# EAGLE design QBar-Graph-V1 (EAGLE 6.0)
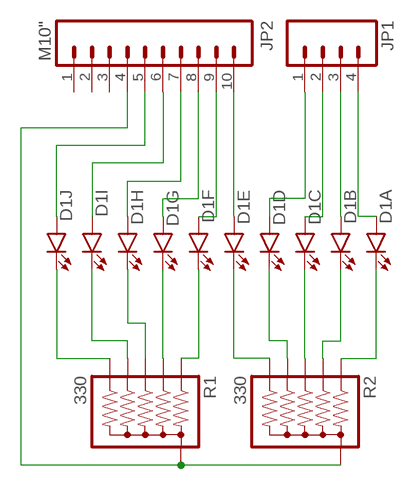
[diagram p0: schematic, sheet 1]

## Parts
D1  LED_BARGRAPH_10  [LED_BARGAPH_10]
JP1  M04PTH  [1X04]
JP2  M10"  [1X10]
R1  330  RPACK-BUSSED-SIP-PTH-5  [RPACK-SIP-PTH-5]
R2  330  RPACK-BUSSED-SIP-PTH-5  [RPACK-SIP-PTH-5]

## Nets
N$1: D1.11(J:C) R1.P$6
N$2: D1.12(I:C) R1.P$5
N$3: D1.13(H:C) R1.P$4
N$4: D1.14(G:C) R1.P$3
N$5: D1.15(F:C) R1.P$2
N$6: D1.20(A:C) R2.P$2
N$7: D1.19(B:C) R2.P$3
N$8: D1.18(C:C) R2.P$4
N$9: D1.17(D:C) R2.P$5
N$10: D1.16(E:C) R2.P$6
N$11: JP2.4 R1.P$1 R2.P$1
N$12: D1.1(A:A) JP1.4
N$13: D1.2(B:A) JP1.3
N$14: D1.3(C:A) JP1.2
N$15: D1.4(D:A) JP1.1
N$16: D1.5(E:A) JP2.10
N$17: D1.6(F:A) JP2.9
N$18: D1.7(G:A) JP2.8
N$19: D1.8(H:A) JP2.7
N$20: D1.9(I:A) JP2.6
N$21: D1.10(J:A) JP2.5
Unconnected: JP2.1 JP2.2 JP2.3

## Library data of the parts
D1 = SFE LED:LED_BARGRAPH_10: 10-Segment LED Bar Graph SFE part numbers: COM-09935 (red, Vf = 2.1V, Ifmax = 20mA) COM-09936 (yellow, Vf = 2.1V, Ifmax = 20mA) COM-09937 (blue, Vf = 3.4V, Ifmax = 20mA) COM-09938 (green, Vf = 3.4V, Ifmax = 20mA)
JP1 = SFE Connectors:M04: Header 4 Standard 4-pin 0.1" header. Use with straight break away headers (SKU : PRT-00116), right angle break away headers (PRT-00553), swiss pins (PRT-00743), machine pins (PRT-00117), and female headers (PRT-00115). Molex polarized connector foot print use with SKU : PRT-08231 with associated crimp pins and housings. 1MM SMD Version SKU: PRT-10208
JP2 = SFE Connectors:M10: Header 10 Standard 10-pin 0.1" header. Use with straight break away headers (SKU : PRT-00116), right angle break away headers (PRT-00553), swiss pins (PRT-00743), machine pins (PRT-00117), and female headers (PRT-00115).
R1 R2 = SFE Passives:RPACK*: BOURNS 4600X series thick-film SIP resistor packs Five resistors bussed to a single pin (denoted by dot). 0.2W / resistor datasheet <http://dlnmh9ip6v2uc.cloudfront.net/datasheets/Components/General/4600x.pdf> SFE parts COM-10855 (330), COM-10856 (10K)

## Board
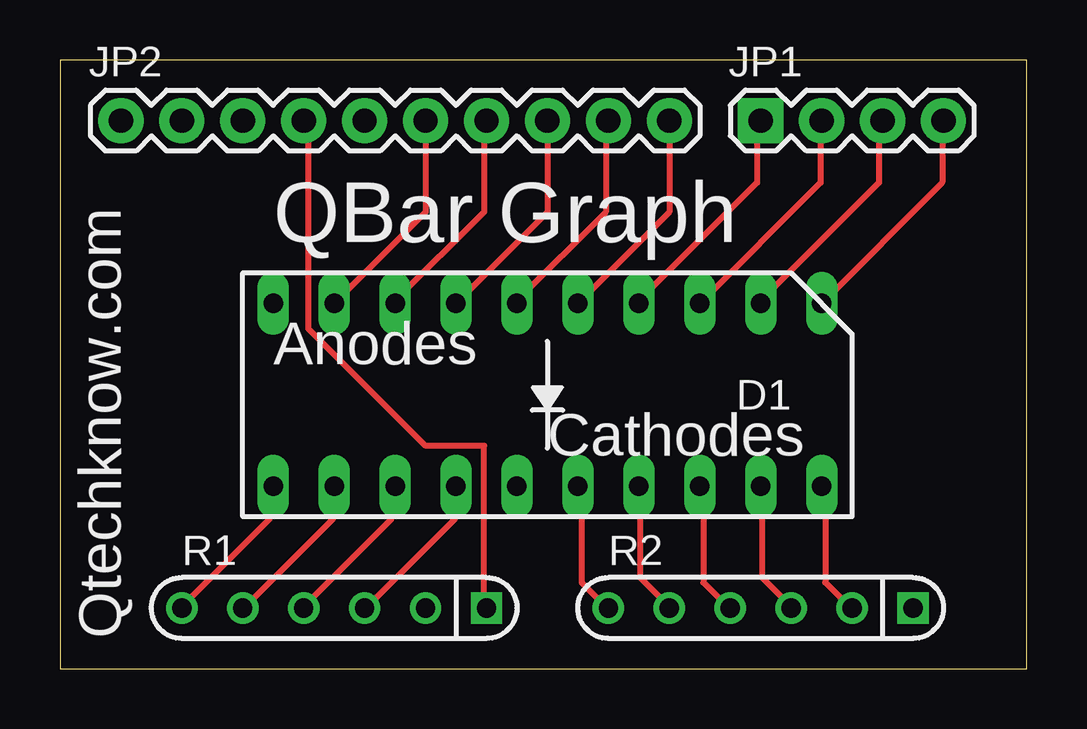
[diagram p1: board, top side]
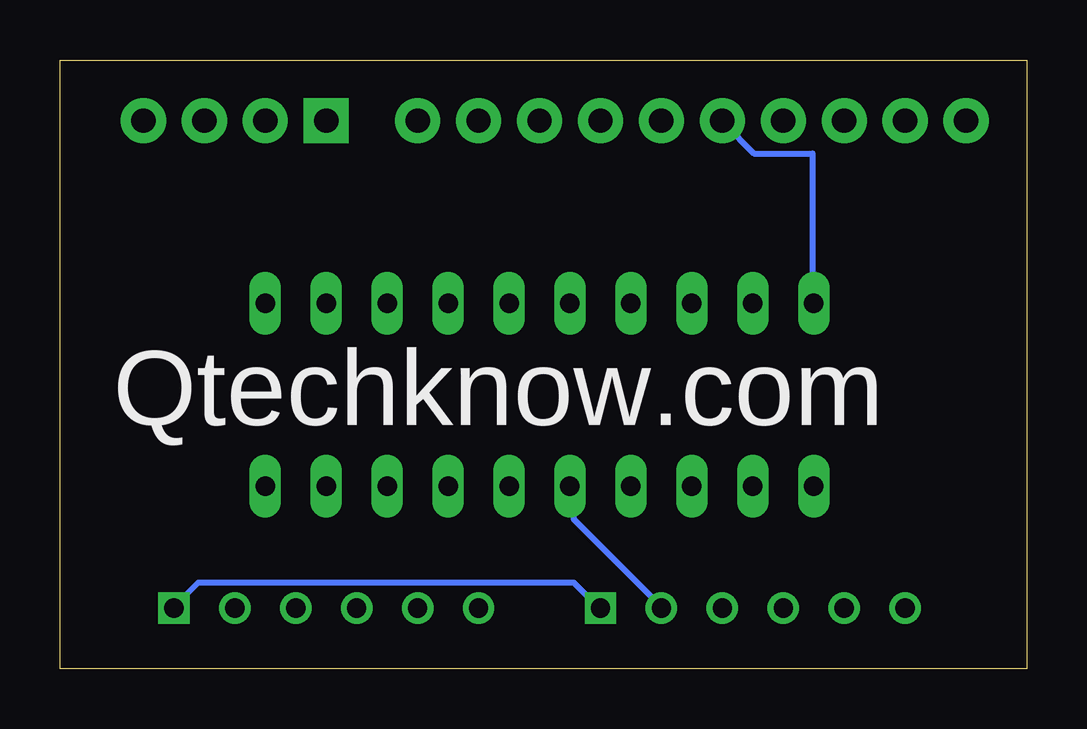
[diagram p2: board, bottom side, seen from below]

Size 40.31 x 25.39 mm. Coordinates in mm from the lower left corner, seen from the top.
Outline: 0,0 40.31,0 40.31,25.39 0,25.39 0,0
Copper layers (1*16): Top 0.035mm / dielectric 1.5mm / Bottom 0.035mm
Design rules: minimum track width 10mil, minimum drill 24mil, track to track 8mil, track to pad 8mil, pad to pad 8mil, via to via 8mil, smd to smd 8mil, copper to edge 40mil, drill to drill 8mil, minimum pad ring 10mil, minimum via ring 8mil, stop-mask expansion 4mil, vias tented up to drill 0mil, thermal gap 10mil

### Footprints (pad centres in the part's own frame; a part is rotated, then mirrored left to right if it is on the bottom)
LED_BARGAPH_10 = drill 0.813 long: 1 -11.43,-3.81; 2 -8.89,-3.81; 3 -6.35,-3.81; 4 -3.81,-3.81; 5 -1.27,-3.81; 6 1.27,-3.81; 7 3.81,-3.81; 8 6.35,-3.81; 9 8.89,-3.81; 10 11.43,-3.81; 11 11.43,3.81; 12 8.89,3.81; 13 6.35,3.81; 14 3.81,3.81; 15 1.27,3.81; 16 -1.27,3.81; 17 -3.81,3.81; 18 -6.35,3.81; 19 -8.89,3.81; 20 -11.43,3.81
1X04 = drill 1.016 pad 1.88 square: 1 0,0 | drill 1.016 pad 1.88: 2 2.54,0; 3 5.08,0; 4 7.62,0
1X10 = drill 1.016 pad 1.88: 1 0,0; 2 2.54,0; 3 5.08,0; 4 7.62,0; 5 10.16,0; 6 12.7,0; 7 15.24,0; 8 17.78,0; 9 20.32,0; 10 22.86,0
RPACK-SIP-PTH-5 = drill 0.8 square: P$1 0,0 | drill 0.8: P$2 0,-2.54; P$3 0,-5.08; P$4 0,-7.62; P$5 0,-10.16; P$6 0,-12.7

### Placement (x,y rotation side)
D1  20.32,11.43 180 top
JP1  29.21,22.86 0 top
JP2  2.54,22.86 0 top
R1  [RPACK-SIP-PTH-5]  17.78,2.54 270 top
R2  [RPACK-SIP-PTH-5]  35.56,2.54 270 top

### Tracks (layer width: path | path; a pad name or v marks a point on that pad's centre or on a via)
N$1
  Top 0.254: R1.P$6 5.08,2.59 8.74,6.25 8.74,7.47 D1.11
N$2
  Top 0.254: R1.P$5 7.72,2.59 11.38,6.25 11.38,7.47 D1.12
N$3
  Top 0.254: R1.P$4 10.16,2.59 13.82,6.25 13.82,7.47 D1.13
N$4
  Top 0.254: R1.P$3 12.8,2.59 16.46,6.25 16.46,7.47 D1.14
N$5
  Bottom 0.254: R1.P$2 15.24,2.59 18.9,6.25 18.9,7.47 D1.15
N$6
  Top 0.254: R2.P$2 32.92,2.59 31.9,3.61 31.9,7.47 D1.20
N$7
  Top 0.254: R2.P$3 30.48,2.59 29.26,3.81 29.26,7.47 D1.19
N$8
  Top 0.254: R2.P$4 27.84,2.59 26.82,3.61 26.82,7.47 D1.18
N$9
  Top 0.254: R2.P$5 25.4,2.59 24.18,3.81 24.18,7.47 D1.17
N$10
  Top 0.254: R2.P$6 22.76,2.59 21.74,3.61 21.74,7.47 D1.16
N$11
  Top 0.254: JP2.4 10.16,22.71 10.36,22.5 10.36,14.17 15.24,9.3 17.68,9.3 17.68,2.59 R1.P$1
  Bottom 0.254: R1.P$1 17.88,2.59 18.9,3.61 34.54,3.61 35.56,2.59 R2.P$1
N$12
  Top 0.254: D1.1 36.78,20.27 36.78,22.71 JP1.4
N$13
  Top 0.254: D1.2 29.26,15.39 34.14,20.27 34.14,22.71 JP1.3
N$14
  Top 0.254: D1.3 31.7,20.27 31.7,22.71 JP1.2
N$15
  Top 0.254: D1.4 24.18,15.39 29.06,20.27 29.06,22.71 JP1.1
N$16
  Top 0.254: D1.5 25.4,19.05 JP2.10
N$17
  Top 0.254: D1.6 19.1,15.39 22.76,19.05 22.76,22.71 JP2.9
N$18
  Top 0.254: D1.7 20.32,19.05 JP2.8
N$19
  Top 0.254: D1.8 14.02,15.39 17.68,19.05 17.68,22.71 JP2.7
N$20
  Top 0.254: D1.9 15.24,19.05 JP2.6
N$21
  Bottom 0.254: D1.10 8.94,15.39 8.94,21.49 11.38,21.49 12.6,22.71 JP2.5

### Text on the board
tPlace: QBar Graph | Anodes | Cathodes | Qtechknow.com
bPlace: Qtechknow.com